# Altium schematic sheet 04_ESP32_UART.SchDoc
size A4; SheetNumber: 3; SheetTotal: 7
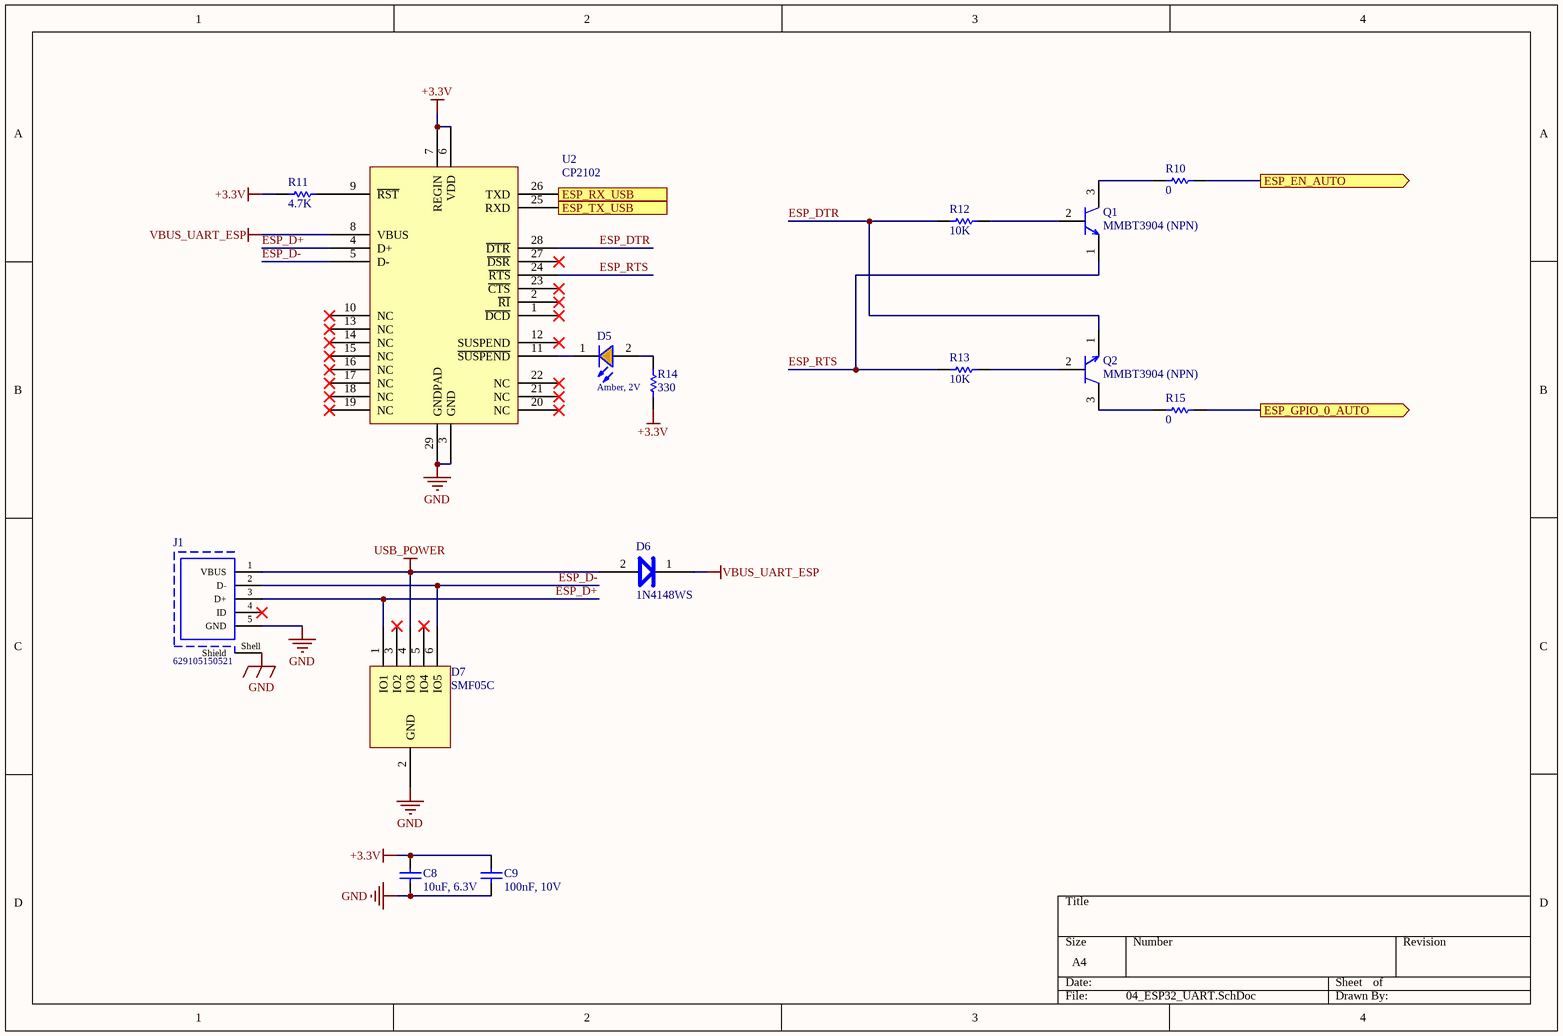
[diagram p0: 04_ESP32_UART.SchDoc]

## Parts
C8  10uF, 6.3V  [WCAP-CSGP_0603_H=0.8mm_Reflow]
C9  100nF, 10V  [WCAP-CSGP_0603_H=0.8mm_Reflow]
D5  Amber, 2V  [WL-SMCW_0603_H=0.7mm]
D6  1N4148WS  [SODFL250X90-2N]
D7  SMF05C  [SOT65P210X110-6N]
J1  629105150521  [629105150521]
Q1  MMBT3904 (NPN)  [SOT95P245X110-3N]
Q2  MMBT3904 (NPN)  [SOT95P245X110-3N]
R10  value 0  [RES-SM-0603]  (hidden comment: RESISTOR SMD)
R11  value 4.7K  [RES-SM-0603]  (hidden comment: RESISTOR SMD)
R12  value 10K  [RES-SM-0603]  (hidden comment: RESISTOR SMD)
R13  value 10K  [RES-SM-0603]  (hidden comment: RESISTOR SMD)
R14  value 330  [RES-SM-0603]  (hidden comment: RESISTOR SMD)
R15  value 0  [RES-SM-0603]  (hidden comment: RESISTOR SMD)
U2  CP2102  [QFN50P500X500X90_HS-29N]

## Ports
ESP_EN_AUTO (out), ESP_GPIO_0_AUTO (out), ESP_RX_USB (out), ESP_TX_USB (in)

## Nets
+3.3V: C8.2 C9.2 R11.2 R14.2 U2.6(VDD) U2.7(REGIN)
GND: C8.1 C9.1 D7.2(GND) J1.5(GND) J1.Shell(Shield) U2.3(GND) U2.29(GNDPAD)
USB_POWER: D6.2 D7.4(IO3) J1.1(VBUS)
VBUS_UART_ESP: D6.1 U2.8(VBUS)
ESP_D+: D7.1(IO1) J1.3(D+) U2.4(D+)
ESP_D-: D7.6(IO5) J1.2(D-) U2.5(D-)
ESP_DTR: Q2.1 R12.1 U2.28(~{DTR})
ESP_EN_AUTO: R10.2 ; port ESP_EN_AUTO
ESP_GPIO_0_AUTO: R15.2 ; port ESP_GPIO_0_AUTO
ESP_RTS: Q1.1 R13.1 U2.24(~{RTS})
ESP_RX_USB: U2.26(TXD) ; port ESP_RX_USB
ESP_TX_USB: U2.25(RXD) ; port ESP_TX_USB
NetD5_1: D5.1(K) U2.11(~{SUSPEND})
NetD5_2: D5.2(A) R14.1
NetQ1_2: Q1.2 R12.2
NetQ1_3: Q1.3 R10.1
NetQ2_2: Q2.2 R13.2
NetQ2_3: Q2.3 R15.1
NetR11_1: R11.1 U2.9(~{RST})

Not connected (* = marked no-connect by the designer): D7 3(IO2)* 5(IO4)*; J1 4(ID)*; U2 1(~{DCD})* 2(~{RI})* 10(NC)* 12(SUSPEND)* 13(NC)* 14(NC)* 15(NC)* 16(NC)* 17(NC)* 18(NC)* 19(NC)* 20(NC)* 21(NC)* 22(NC)* 23(~{CTS})* 27(~{DSR})*

## Library data of the parts
C8 = 885012106006: WCAP-CSGP Multilayer Ceramic Chip Capacitor, General Purpose, size 0603, X5R, 10uF, 6.3V; Manufacturer: Wurth Elektronik; Rated Voltage: 6.3VDC; Isolation Resistance: >=0.01GOhm; Capacitance Tolerance: +/-20%; Technical Reference: X5R0603106M6R3DFCT10000; ComponentLink1Description: Manufacturer; ComponentLink1URL: http://www.we-online.de; ComponentLink2Description: Datasheet; ComponentLink2URL: https://www.we-online.com/catalog/datasheet/885012106006.pdf; Operating Temperature: -55 to +85degC; Packaging: Tape and Reel; Manufacturer Part Number: 885012106006; Published Date: May 2020; Ceramic Type: X5R; Dissipation Factor: =<10%; Height: 0.8mm; Mounting Technology: SMT; Size: 0603; Capacitance: 10uF
C9 = 885012206020: WCAP-CSGP Multilayer Ceramic Chip Capacitor, General Purpose, size 0603, X7R, 100nF, 10V; Manufacturer: Wurth Elektronik; Rated Voltage: 10VDC; Isolation Resistance: >=5GOhm; Capacitance Tolerance: +/-10%; Technical Reference: X7R0603104K010DFCT10000; ComponentLink1Description: Manufacturer; ComponentLink1URL: http://www.we-online.de; ComponentLink2Description: Datasheet; ComponentLink2URL: https://www.we-online.com/catalog/datasheet/885012206020.pdf; Operating Temperature: -55 to +125degC; Packaging: Tape and Reel; Manufacturer Part Number: 885012206020; Published Date: May 2020; Ceramic Type: X7R; Dissipation Factor: =<5%; Height: 0.8mm; Mounting Technology: SMT; Size: 0603; Capacitance: 100nF
D5 = 150060AS75000: WL-SMCW SMT Mono-color Chip LED Waterclear, size 0603, Amber, 2V, 140deg; Chip Technology: AlInGaP; Dominant Wavelength typ.: 605nm; Luminous Intensity typ.: 130mcd; Peak Wavelength typ.: 610nm; Viewing Angle: 140deg; ComponentLink1Description: Manufacturer; ComponentLink1URL: http://www.we-online.de; ComponentLink2URL: https://www.we-online.com/catalog/datasheet/150060AS75000.pdf; ComponentLink2Description: Datasheet; Forward Voltage typ.: 2V; Emitting Color: Amber; Mounting Technology: SMT; Operating Temperature: -40 to +85degC; Published Date: December 2019; Part Number: 150060AS75000; Packaging: Tape and Reel; Size: 0603; Publisher: Wurth Elektronik
J1 = 629105150521: Micro USB 2.0 Type B Receptacle WR-COM, Horizontal, SMT, with Pegs, High Current at Pin 1 & Pin 5; Rated Current: 3 A; Contact Resistance: 30 mOhm; Working Voltage: 30 VAC; ComponentLink1Description: Manufacturer; ComponentLink1URL: http://www.we-online.de; ComponentLink2Description: Datasheet; ComponentLink2URL: https://katalog.we-online.de/em/datasheet/629105150521.pdf; Part Number: 629105150521; Published Date: September 2018; Publisher: Wurth Elektronik; Orientation: Horizontal; Connector Type: Micro USB 2.0 Type B; Operating Temperature: -40 to 85 degC; Mounting Technology: SMT; Gender: Receptacle; Packaging: Tape and Reel
Q1 Q2 = MMBT3904 (NPN): Manufacturer: On Semiconductor; ComponentLink1Description: Local link; ComponentLink1URL: https://www.thegioiic.com/products/mmbt3904-1am; Local supplier: thegioiic; Local supplier PN: MMBT3904-1AM; Manufacturer P/N: MMBT3904
R10-R15 = RESISTOR SMD: Resistor